# EAGLE schematic P3DA (EAGLE 7.7.0)
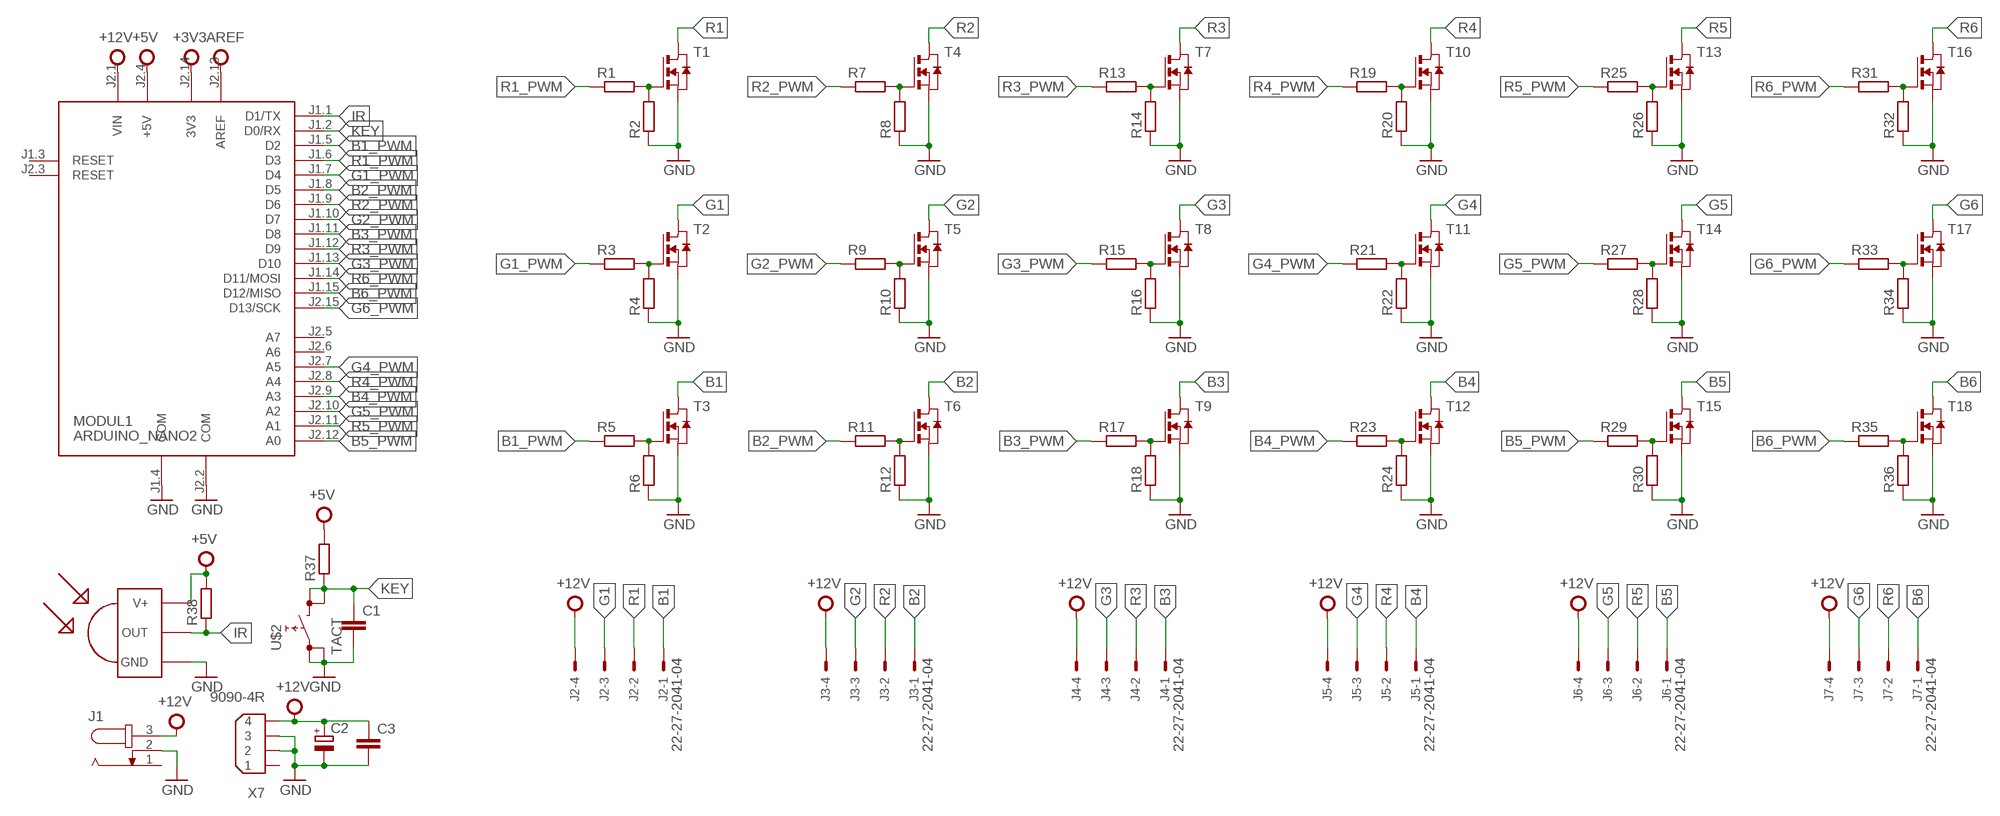
[diagram p0: schematic, sheet 1]

## Parts
C1  C-EUC0805  [C0805]
C2  CPOL-EUE5-13  [E5-13]
C3  C-EUC1206  [C1206]
J1  JACK-PLUG1  [SPC4078]
J2  22-27-2041-04  [6410-04]
J3  22-27-2041-04  [6410-04]
J4  22-27-2041-04  [6410-04]
J5  22-27-2041-04  [6410-04]
J6  22-27-2041-04  [6410-04]
J7  22-27-2041-04  [6410-04]
MODUL1  ARDUINO_NANO2  [ARDUINO_NANO2]
R1  R-EU_R0805  [R0805]
R2  R-EU_R0805  [R0805]
R3  R-EU_R0805  [R0805]
R4  R-EU_R0805  [R0805]
R5  R-EU_R0805  [R0805]
R6  R-EU_R0805  [R0805]
R7  R-EU_R0805  [R0805]
R8  R-EU_R0805  [R0805]
R9  R-EU_R0805  [R0805]
R10  R-EU_R0805  [R0805]
R11  R-EU_R0805  [R0805]
R12  R-EU_R0805  [R0805]
R13  R-EU_R0805  [R0805]
R14  R-EU_R0805  [R0805]
R15  R-EU_R0805  [R0805]
R16  R-EU_R0805  [R0805]
R17  R-EU_R0805  [R0805]
R18  R-EU_R0805  [R0805]
R19  R-EU_R0805  [R0805]
R20  R-EU_R0805  [R0805]
R21  R-EU_R0805  [R0805]
R22  R-EU_R0805  [R0805]
R23  R-EU_R0805  [R0805]
R24  R-EU_R0805  [R0805]
R25  R-EU_R0805  [R0805]
R26  R-EU_R0805  [R0805]
R27  R-EU_R0805  [R0805]
R28  R-EU_R0805  [R0805]
R29  R-EU_R0805  [R0805]
R30  R-EU_R0805  [R0805]
R31  R-EU_R0805  [R0805]
R32  R-EU_R0805  [R0805]
R33  R-EU_R0805  [R0805]
R34  R-EU_R0805  [R0805]
R35  R-EU_R0805  [R0805]
R36  R-EU_R0805  [R0805]
R37  R-EU_R0805  [R0805]
R38  R-EU_R0805  [R0805]
T1  NMOSSOT23  [SOT-23]
T2  NMOSSOT23  [SOT-23]
T3  NMOSSOT23  [SOT-23]
T4  NMOSSOT23  [SOT-23]
T5  NMOSSOT23  [SOT-23]
T6  NMOSSOT23  [SOT-23]
T7  NMOSSOT23  [SOT-23]
T8  NMOSSOT23  [SOT-23]
T9  NMOSSOT23  [SOT-23]
T10  NMOSSOT23  [SOT-23]
T11  NMOSSOT23  [SOT-23]
T12  NMOSSOT23  [SOT-23]
T13  NMOSSOT23  [SOT-23]
T14  NMOSSOT23  [SOT-23]
T15  NMOSSOT23  [SOT-23]
T16  NMOSSOT23  [SOT-23]
T17  NMOSSOT23  [SOT-23]
T18  NMOSSOT23  [SOT-23]
U$1  TSOP1738  [TSOP17XX]
U$2  TACT  [TL1105]
X7  9090-4R  [9090-4R]

## Nets
+3V3: MODUL1.J2.14(3V3)
+5V: MODUL1.J2.4(+5V) R37.2 R38.2 U$1.V+
+12V: C2.+ C3.1 J1.3 J2.4 J3.4 J4.4 J5.4 J6.4 J7.4 MODUL1.J2.1(VIN) X7.4
AREF: MODUL1.J2.13(AREF)
B1: J2.1 T3.1(D)
B1_PWM: MODUL1.J1.5(D2) R5.1
B2: J3.1 T6.1(D)
B2_PWM: MODUL1.J1.8(D5) R11.1
B3: J4.1 T9.1(D)
B3_PWM: MODUL1.J1.11(D8) R17.1
B4: J5.1 T12.1(D)
B4_PWM: MODUL1.J2.9(A3) R23.1
B5: J6.1 T15.1(D)
B5_PWM: MODUL1.J2.12(A0) R29.1
B6: J7.1 T18.1(D)
B6_PWM: MODUL1.J1.15(D12/MISO) R35.1
G1: J2.3 T2.1(D)
G1_PWM: MODUL1.J1.7(D4) R3.1
G2: J3.3 T5.1(D)
G2_PWM: MODUL1.J1.10(D7) R9.1
G3: J4.3 T8.1(D)
G3_PWM: MODUL1.J1.13(D10) R15.1
G4: J5.3 T11.1(D)
G4_PWM: MODUL1.J2.7(A5) R21.1
G5: J6.3 T14.1(D)
G5_PWM: MODUL1.J2.10(A2) R27.1
G6: J7.3 T17.1(D)
G6_PWM: MODUL1.J2.15(D13/SCK) R33.1
GND: C1.2 C2.- C3.2 J1.2 MODUL1.J1.4(COM) MODUL1.J2.2(COM) R2.1 R4.1 R6.1 R8.1 R10.1 R12.1 R14.1 R16.1 R18.1 R20.1 R22.1 R24.1 R26.1 R28.1 R30.1 R32.1 R34.1 R36.1 T1.2(S) T2.2(S) T3.2(S) T4.2(S) T5.2(S) T6.2(S) T7.2(S) T8.2(S) T9.2(S) T10.2(S) T11.2(S) T12.2(S) T13.2(S) T14.2(S) T15.2(S) T16.2(S) T17.2(S) T18.2(S) U$1.GND U$2.1 U$2.3 X7.2 X7.3
IR: MODUL1.J1.1(D1/TX) R38.1 U$1.OUT
KEY: C1.1 MODUL1.J1.2(D0/RX) R37.1 U$2.2 U$2.4
N$1: R1.2 R2.2 T1.3(G)
N$2: R7.2 R8.2 T4.3(G)
N$3: R9.2 R10.2 T5.3(G)
N$4: R3.2 R4.2 T2.3(G)
N$5: R5.2 R6.2 T3.3(G)
N$6: R11.2 R12.2 T6.3(G)
N$7: R13.2 R14.2 T7.3(G)
N$8: R15.2 R16.2 T8.3(G)
N$9: R17.2 R18.2 T9.3(G)
N$10: R19.2 R20.2 T10.3(G)
N$11: R21.2 R22.2 T11.3(G)
N$12: R23.2 R24.2 T12.3(G)
N$13: R25.2 R26.2 T13.3(G)
N$14: R27.2 R28.2 T14.3(G)
N$15: R29.2 R30.2 T15.3(G)
N$16: R31.2 R32.2 T16.3(G)
N$17: R33.2 R34.2 T17.3(G)
N$18: R35.2 R36.2 T18.3(G)
R1: J2.2 T1.1(D)
R1_PWM: MODUL1.J1.6(D3) R1.1
R2: J3.2 T4.1(D)
R2_PWM: MODUL1.J1.9(D6) R7.1
R3: J4.2 T7.1(D)
R3_PWM: MODUL1.J1.12(D9) R13.1
R4: J5.2 T10.1(D)
R4_PWM: MODUL1.J2.8(A4) R19.1
R5: J6.2 T13.1(D)
R5_PWM: MODUL1.J2.11(A1) R25.1
R6: J7.2 T16.1(D)
R6_PWM: MODUL1.J1.14(D11/MOSI) R31.1
Unconnected: J1.1 MODUL1.J1.3(RESET) MODUL1.J2.3(RESET) MODUL1.J2.5(A7) MODUL1.J2.6(A6) X7.1

## Library data of the parts
C1 C3 = rcl:C-EU: CAPACITOR, European symbol
C2 = rcl:CPOL-EU: POLARIZED CAPACITOR, European symbol
J1 = tango:JACK-PLUG: DC POWER JACK Power Jack, DC, Right Angle, Through Hole, Rated 5A at 16VDC, PC Terminals Distributor: Farnell (www.Farnell.de) Drawing: 84N1161.pdf / 84N1162.pdf Manufacturer: SPC Technology (www.spctechnology.com) Type: SPC4077 / SPC 4078
J2-J7 = EP_molex_6410_7395:22-?-04: CONNECTOR wire to board 2.54 mm (.1 inch) pitch header
MODUL1 = arduino:ARDUINO_NANO2: Arduino Nano2 Auto generated by modulcreator.ulp \;; ANZAHL: 2; MODUL: TRUE; STECKX0: -76200; STECKX1: 76200; STECKY0: 177800; STECKY1: 177800
R1-R38 = rcl:R-EU_: RESISTOR, European symbol
T1-T18 = zetex:NMOSSOT23: MOS FET; OC_FARNELL: unknown; OC_NEWARK: unknown
U$1 = tsop:TSOP1738: IR Receiver and Demodulator
U$2 = switch1:TACT
X7 = con-thomas-betts:9090-4: Disk Drive Power four position Source: Thomas & Betts Electronic Interconnects Eiropean Edition 1998; OC_FARNELL: unknown; OC_NEWARK: unknown